# Altium schematic sheet adc.schdoc: SoRad: Analog to Digital Conversion
size B; Author: Chris Hiszpanski
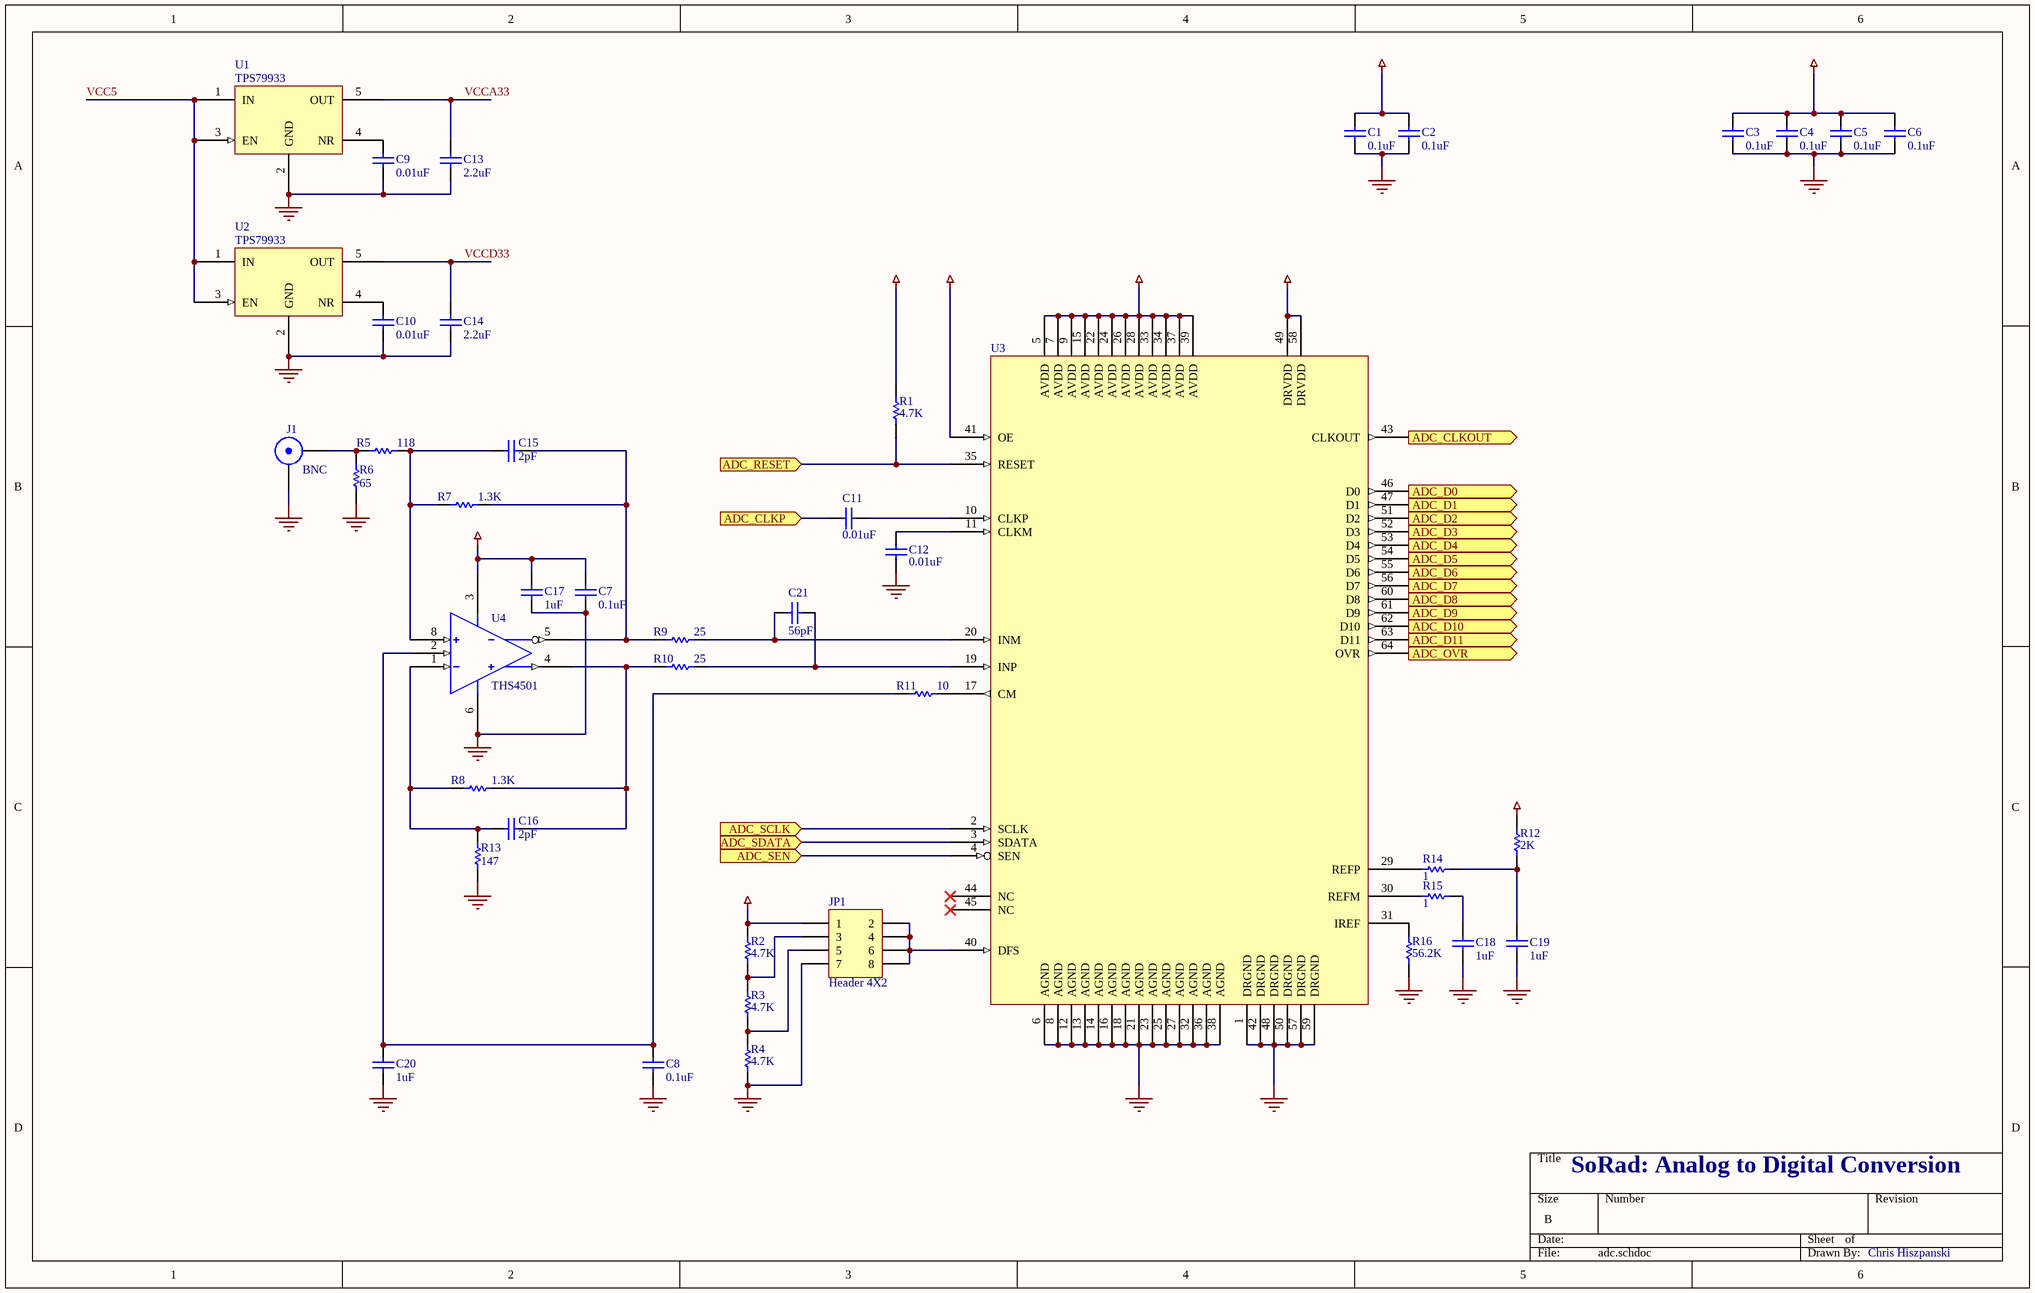
[diagram p0: adc.schdoc]

## Parts
C1  0.1uF  [CC2012-0805]
C2  0.1uF  [CC2012-0805]
C3  0.1uF  [CC2012-0805]
C4  0.1uF  [CC2012-0805]
C5  0.1uF  [CC2012-0805]
C6  0.1uF  [CC2012-0805]
C7  0.1uF  [CC2012-0805]
C8  0.1uF  [CC2012-0805]
C9  0.01uF  [CC2012-0805]
C10  0.01uF  [CC2012-0805]
C11  0.01uF  [CC2012-0805]
C12  0.01uF  [CC2012-0805]
C13  2.2uF  [CC3216-1206]
C14  2.2uF  [CC3216-1206]
C15  2pF  [CC2012-0805]
C16  2pF  [CC2012-0805]
C17  1uF  [CC2012-0805]
C18  1uF  [CC2012-0805]
C19  1uF  [CC2012-0805]
C20  1uF  [CC2012-0805]
C21  56pF  [CC2012-0805]
J1  BNC  [BNC_RA CON]
JP1  Header 4X2  [HDR2X4]
R1  4.7K  [CR2012-0805]
R2  4.7K  [CR2012-0805]
R3  4.7K  [CR2012-0805]
R4  4.7K  [CR2012-0805]
R5  118  [CC2012-0805]
R6  65  [CC2012-0805]
R7  1.3K  [CC2012-0805]
R8  1.3K  [CC2012-0805]
R9  25  [CC2012-0805]
R10  25  [CC2012-0805]
R11  10  [CC2012-0805]
R12  2K  [CC2012-0805]
R13  147  [CC2012-0805]
R14  1  [CC2012-0805]
R15  1  [CC2012-0805]
R16  56.2K  [CC2012-0805]
U1  TPS79933  [SO-G5/P.95]
U2  TPS79933  [SO-G5/P.95]
U3  (no value)  [HQFP64]
U4  THS4501  [SOIC8]

## Ports
ADC_CLKOUT (out), ADC_CLKP (in), ADC_D0 (out), ADC_D1 (out), ADC_D2 (out), ADC_D3 (out), ADC_D4 (out), ADC_D5 (out), ADC_D6 (out), ADC_D7 (out), ADC_D8 (out), ADC_D9 (out), ADC_D10 (out), ADC_D11 (out), ADC_OVR (out), ADC_RESET (in), ADC_SCLK (in), ADC_SDATA (in), ADC_SEN (in)

## Nets
GND: C1.1 C2.1 C3.1 C4.1 C5.1 C6.1 C7.1 C8.1 C9.1 C10.1 C12.2 C13.1 C14.1 C17.1 C18.1 C19.1 C20.1 J1.2(Y) JP1.7 R4.1 R6.2 R13.2 R16.2 U1.2(GND) U2.2(GND) U3.1(DRGND) U3.6(AGND) U3.8(AGND) U3.12(AGND) U3.13(AGND) U3.14(AGND) U3.16(AGND) U3.18(AGND) U3.21(AGND) U3.23(AGND) U3.25(AGND) U3.27(AGND) U3.32(AGND) U3.36(AGND) U3.38(AGND) U3.42(DRGND) U3.48(DRGND) U3.50(DRGND) U3.57(DRGND) U3.59(DRGND) U4.6(Vs-)
VCC5: C7.2 C17.2 U1.1(IN) U1.3(EN) U2.1(IN) U2.3(EN) U4.3(Vs+)
VCCA33: C3.2 C4.2 C5.2 C6.2 C13.2 R12.1 U1.5(OUT) U3.5(AVDD) U3.7(AVDD) U3.9(AVDD) U3.15(AVDD) U3.22(AVDD) U3.24(AVDD) U3.26(AVDD) U3.28(AVDD) U3.33(AVDD) U3.34(AVDD) U3.37(AVDD) U3.39(AVDD)
VCCD33: C1.2 C2.2 C14.2 JP1.1 R1.2 R2.2 U2.5(OUT) U3.41(OE) U3.49(DRVDD) U3.58(DRVDD)
ADC_CLKOUT: U3.43(CLKOUT) ; port ADC_CLKOUT
ADC_CLKP: C11.2 ; port ADC_CLKP
ADC_D0: U3.46(D0) ; port ADC_D0
ADC_D1: U3.47(D1) ; port ADC_D1
ADC_D2: U3.51(D2) ; port ADC_D2
ADC_D3: U3.52(D3) ; port ADC_D3
ADC_D4: U3.53(D4) ; port ADC_D4
ADC_D5: U3.54(D5) ; port ADC_D5
ADC_D6: U3.55(D6) ; port ADC_D6
ADC_D7: U3.56(D7) ; port ADC_D7
ADC_D8: U3.60(D8) ; port ADC_D8
ADC_D9: U3.61(D9) ; port ADC_D9
ADC_D10: U3.62(D10) ; port ADC_D10
ADC_D11: U3.63(D11) ; port ADC_D11
ADC_OVR: U3.64(OVR) ; port ADC_OVR
ADC_RESET: R1.1 U3.35(RESET) ; port ADC_RESET
ADC_SCLK: U3.2(SCLK) ; port ADC_SCLK
ADC_SDATA: U3.3(SDATA) ; port ADC_SDATA
ADC_SEN: U3.4(SEN) ; port ADC_SEN
NetC8_2: C8.2 C20.2 R11.2 U4.2(Vocm)
NetC9_2: C9.2 U1.4(NR)
NetC10_2: C10.2 U2.4(NR)
NetC11_1: C11.1 U3.10(CLKP)
NetC12_1: C12.1 U3.11(CLKM)
NetC15_1: C15.1 R7.1 R9.2 U4.5(Vout-)
NetC15_2: C15.2 R5.1 R7.2 U4.8(Vin+)
NetC16_1: C16.1 R8.1 R10.2 U4.4(Vout+)
NetC16_2: C16.2 R8.2 R13.1 U4.1(Vin-)
NetC18_2: C18.2 R15.2
NetC19_2: C19.2 R12.2 R14.2
NetC21_1: C21.1 R9.1 U3.20(INM)
NetC21_2: C21.2 R10.1 U3.19(INP)
NetJ1_1: J1.1(X) R5.2 R6.1
NetJP1_2: JP1.2 JP1.4 JP1.6 JP1.8 U3.40(DFS)
NetJP1_3: JP1.3 R2.1 R3.2
NetJP1_5: JP1.5 R3.1 R4.2
NetR11_1: R11.1 U3.17(CM)
NetR14_1: R14.1 U3.29(REFP)
NetR15_1: R15.1 U3.30(REFM)
NetR16_1: R16.1 U3.31(IREF)

Not connected (* = marked no-connect by the designer): U3 44(NC)* 45(NC)*

## Library data of the parts
C1-C8 = Cap: Capacitor; Manufacturer: Panasonic; Manufacturer Part Number: ECJ-2VF1C104Z; Published: 8-Jun-2000; Revision: July-2002: Re-released for DXP Platform.; Publisher: Altium Limited; Value: 0.1uF; Distributor: Digikey; Distributor Part Number: PCC1843CT-ND
C9-C12 = Cap: Capacitor; Manufacturer: Panasonic; Manufacturer Part Number: ECJ-2VF1H103Z; Published: 8-Jun-2000; Revision: July-2002: Re-released for DXP Platform.; Publisher: Altium Limited; Value: 0.01uF; Distributor: Digikey; Distributor Part Number: PCC1858CT-ND
C13 C14 = Cap: Capacitor; Manufacturer: Panasonic; Manufacturer Part Number: ECJ-3VF1C225Z; Published: 8-Jun-2000; Revision: July-2002: Re-released for DXP Platform.; Publisher: Altium Limited; Value: 2.2uF; Distributor: Digikey; Distributor Part Number: PCC1898CT-ND
C15 C16 = Cap: Capacitor; Manufacturer: Cornell Dubilier; Manufacturer Part Number: MC08CA020D-F; Published: 8-Jun-2000; Revision: July-2002: Re-released for DXP Platform.; Publisher: Altium Limited; Value: 2pF; Distributor: Digikey; Distributor Part Number: 338-1096-ND
C17-C20 = Cap: Capacitor; Manufacturer: Panasonic; Manufacturer Part Number: ECJ-2VF1C105Z; Published: 8-Jun-2000; Revision: July-2002: Re-released for DXP Platform.; Publisher: Altium Limited; Value: 1uF; Distributor: Digikey; Distributor Part Number: PCC1849CT-ND
C21 = Cap: Capacitor; Manufacturer: Yageo; Manufacturer Part Number: CC0805JRNP09BN560; Published: 8-Jun-2000; Revision: July-2002: Re-released for DXP Platform.; Publisher: Altium Limited; Value: 56pF; Distributor: Digikey; Distributor Part Number: 311-1108-1-ND
J1 = BNC: BNC Elbow Connector; Manufacturer: Amp; Manufacturer: 227161-1; Revision: 17-Jul-2002: Re-released for DXP Platform.; Publisher: Altium Limited; Distributor: Digikey; Distributor Part Number: A24486-ND
JP1 = Header 4X2: Header, 4-Pin, Dual row; Manufacturer: NA; Revision: 17-Jul-2002: Re-released for DXP Platform.; Publisher: Altium Limited; Distributor: Stockroom; Distributor Part Number: NA; Manufacturer Part Number: NA
R1-R4 = Res1: Resistor; Manufacturer: Generic Components; Manufacturer: Vishay/Dale; Manufacturer Part Number: CRCW08054K70JNEA; Class I: Passive; Published: 8-Jun-2000; Revision: July-2002: Re-released for DXP Platform.; Publisher: Altium Limited; Class II: Resistor; Value: 4.7K; Distributor: Digikey; Distributor Part Number: 541-4.7KACT-ND
R5 = Res1: Resistor; Manufacturer: Yageo; Manufacturer Part Number: 9C08052A1180FKHFT; Published: 8-Jun-2000; Revision: July-2002: Re-released for DXP Platform.; Publisher: Altium Limited; Value: 118; Distributor: Digikey; Distributor Part Number: 311-118CCT-ND
R6 = Res1: Resistor; Manufacturer: Yageo; Manufacturer Part Number: 9C08052A64R9FKHFT; Published: 8-Jun-2000; Revision: July-2002: Re-released for DXP Platform.; Publisher: Altium Limited; Value: 65; Distributor: Digikey; Distributor Part Number: 311-64.9CCT-ND
R7 R8 = Res1: Resistor; Manufacturer: Rohm; Manufacturer Part Number: MCR10EZHF1301; Published: 8-Jun-2000; Revision: July-2002: Re-released for DXP Platform.; Publisher: Altium Limited; Value: 1.3K; Distributor: Digikey; Distributor Part Number: RHM1.30KCCT-ND
R9 R10 = Res1: Resistor; Manufacturer: Vishay/Dale; Manufacturer Part Number: CRCW080524R9FKEA; Published: 8-Jun-2000; Revision: July-2002: Re-released for DXP Platform.; Publisher: Altium Limited; Value: 25; Distributor: Digikey; Distributor Part Number: 541-24.9CCT-ND
R11 = Res1: Resistor; Manufacturer: Yageo; Manufacturer Part Number: RC0805FR-0710RL; Published: 8-Jun-2000; Revision: July-2002: Re-released for DXP Platform.; Publisher: Altium Limited; Value: 10; Distributor: Digikey; Distributor Part Number: 311-10.0CRCT-ND
R12 = Res1: Resistor; Manufacturer: Yageo; Manufacturer Part Number: RC0805FR-072KL; Published: 8-Jun-2000; Revision: July-2002: Re-released for DXP Platform.; Publisher: Altium Limited; Value: 2K; Distributor: Digikey; Distributor Part Number: 311-2.00KCRCT-ND
R13 = Res1: Resistor; Manufacturer: Yageo; Manufacturer Part Number: RC0805FR-07147RL; Published: 8-Jun-2000; Revision: July-2002: Re-released for DXP Platform.; Publisher: Altium Limited; Value: 147; Distributor: Digikey; Distributor Part Number: 311-147CRCT-ND
R14 R15 = Res1: Resistor; Manufacturer: Yageo; Manufacturer Part Number: RC0805FR-071RL; Published: 8-Jun-2000; Revision: July-2002: Re-released for DXP Platform.; Publisher: Altium Limited; Value: 1; Distributor: Digikey; Distributor Part Number: 311-1.00CRCT-ND
R16 = Res1: Resistor; Manufacturer: Yageo; Manufacturer Part Number: RC0805FR-0756K2L; Published: 8-Jun-2000; Revision: July-2002: Re-released for DXP Platform.; Publisher: Altium Limited; Value: 56.2K; Distributor: Digikey; Distributor Part Number: 311-56.2KCRCT-ND
U1 U2 = TPS799xx: LDO Voltage Regulator; Manufacturer: Texas Instruments; Manufacturer Part Number: TPS79933DDCR; Distributor: Digikey; Distributor Part Number: 296-17783-1-ND
U3 = ADS5520: ADC 12BIT 125MSPS; Manufacturer: Texas Instruments; Manufacturer Part Number: ADS5520IPAP; Distributor: Digikey; Distributor Part Number: 296-17702-ND
U4 = THS4501: Differential Amplifier; Manufacturer: Texas Instruments; Manufacturer Part Number: THS4501ID; Distributor: Digikey; Distributor Part Number: 296-12936-5-ND